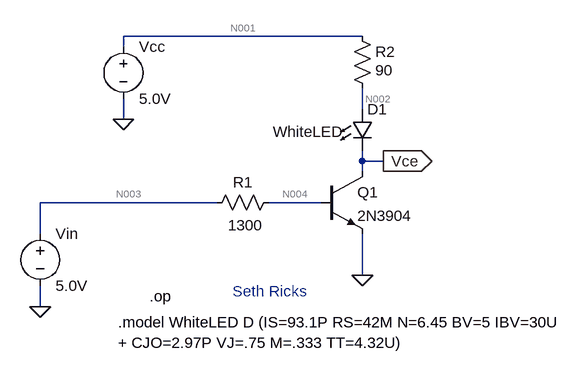
[diagram p0: schematic question_2.asc]
question_2.asc, the LTspice schematic file:
Version 4.1
SHEET 1 880 680
WIRE 160 -64 -208 -64
WIRE -208 -48 -208 -64
WIRE 160 48 160 16
WIRE -208 64 -208 32
WIRE 160 128 160 112
WIRE 192 128 160 128
WIRE 160 144 160 128
WIRE -64 192 -336 192
WIRE 96 192 16 192
WIRE -336 240 -336 192
WIRE 160 304 160 240
WIRE -336 352 -336 320
FLAG -208 64 0
FLAG 160 304 0
FLAG -336 352 0
FLAG 192 128 Vce
IOPIN 192 128 Out
SYMBOL voltage -336 224 R0
SYMATTR InstName Vin
SYMATTR Value 5.0V
SYMBOL voltage -208 -64 R0
SYMATTR InstName Vcc
SYMATTR Value 5.0V
SYMBOL res 144 -80 R0
WINDOW 3 36 68 Left 2
SYMATTR InstName R2
SYMATTR Value 90
SYMBOL res 32 176 R90
WINDOW 0 0 56 VBottom 2
WINDOW 3 66 52 VBottom 2
SYMATTR InstName R1
SYMATTR Value 1300
SYMBOL npn 96 144 R0
SYMATTR InstName Q1
SYMATTR Value 2N3904
SYMBOL LED 144 48 R0
WINDOW 3 -122 35 Left 2
SYMATTR InstName D1
SYMATTR Value WhiteLED
TEXT -216 376 Left 2 !.model WhiteLED D (IS=93.1P RS=42M N=6.45 BV=5 IBV=30U\n+ CJO=2.97P VJ=.75 M=.333 TT=4.32U)
TEXT -168 336 Left 2 !.op
TEXT -40 328 Left 2 ;Seth Ricks

The netlist it stands for:
* question_2.asc
Vin N003 0 5.0V
Vcc N001 0 5.0V
R2 N001 N002 90
R1 N004 N003 1300
Q1 Vce N004 0 0 2N3904
D1 N002 Vce WhiteLED
.model D D
.lib standard.dio
.model NPN NPN
.model PNP PNP
.lib standard.bjt
.model WhiteLED D (IS=93.1P RS=42M N=6.45 BV=5 IBV=30U
+ CJO=2.97P VJ=.75 M=.333 TT=4.32U)
.op
* Seth Ricks
.backanno
.end

* Results of the author's LTspice run, read from the files saved beside the schematic
* Operating Point:
*   V(n001) = 5 V
*   V(n002) = 3.231 V
*   V(n003) = 5 V
*   V(n004) = 815.4 mV
*   V(vce) = 32.75 mV
*   I(D1) = 19.65 mA
*   I(R1) = -3.219 mA
*   I(R2) = 19.65 mA
*   I(Vcc) = -19.65 mA
*   I(Vin) = -3.219 mA
*   Ib(Q1) = 3.219 mA
*   Ic(Q1) = 19.65 mA
*   Ie(Q1) = -22.87 mA
*   Is(Q1) = 0 A